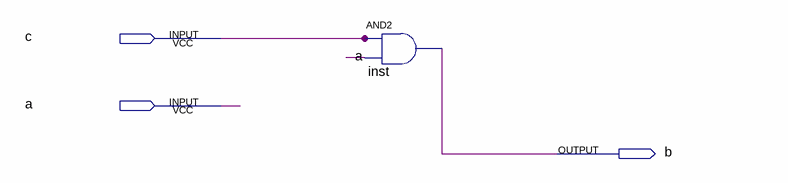
[diagram p0: schematic sheet]
// Quartus schematic top.bdf as structural Verilog: 1 symbols, 3 pins
module top (
  input  c,
  input  a,
  output b
);

  and inst (b, c, a);
endmodule
